# Altium project Bela_fan_control.PrjPcb
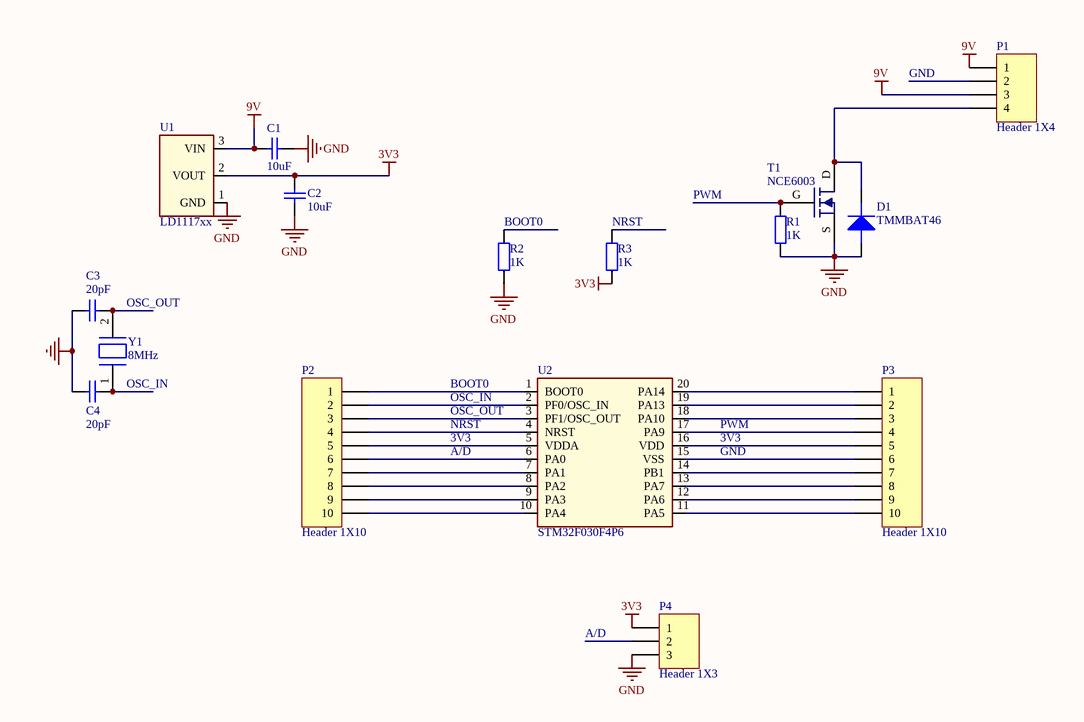
[diagram p0: Bela_fan_control.SchDoc]
1 sheet, 16 parts. Net scope: global (net labels, ports and power ports of the same name join across sheets).
Board file: Bela_fan_control.PcbDoc

## Sheet Bela_fan_control.SchDoc
size A3

### Parts
C1  10uF  [FP_1206_CAP_085]
C2  10uF  [FP_1206_CAP_085]
C3  20pF  [FP_0603_CAP_080]
C4  20pF  [FP_0603_CAP_080]
D1  TMMBAT46  [SOD-80]
P1  Header 1X4  [HEADER_2.54MM_M_1x4]
P2  Header 1X10  [HEADER_2.54MM_M_1x10]
P3  Header 1X10  [HEADER_2.54MM_M_1x10]
P4  Header 1X3  [HEADER_2.54MM_M_1x3]
R1  1K  [FP_0603_RES]
R2  1K  [FP_0603_RES]
R3  1K  [FP_0603_RES]
T1  NCE6003  [FET_SOT23]
U1  LD1117xx  [SUPPLY_SOT223]
U2  STM32F030F4P6  [uC_TSSOP20]
Y1  8MHz  [FP_CRYSTAL_HC49_SMD]

### Nets
3V3: C2.2 P2.5 P3.5 P4.1 R3.2 U1.2(VOUT) U2.5(VDDA) U2.16(VDD)
9V: C1.2 P1.1 P1.3 U1.3(VIN)
GND: C1.1 C2.1 C3.1 C4.1 D1.A P1.2 P3.6 P4.3 R1.2 R2.2 T1.S U1.1(GND) U2.15(VSS)
A/D: P2.6 P4.2 U2.6(PA0)
BOOT0: P2.1 R2.1 U2.1(BOOT0)
NRST: P2.4 R3.1 U2.4(NRST)
OSC_IN: C4.2 P2.2 U2.2(PF0/OSC_IN) Y1.1
OSC_OUT: C3.2 P2.3 U2.3(PF1/OSC_OUT) Y1.2
PWM: P3.4 R1.1 T1.G U2.17(PA9)
NetD1_K: D1.K P1.4 T1.D
NetP2_7: P2.7 U2.7(PA1)
NetP2_8: P2.8 U2.8(PA2)
NetP2_9: P2.9 U2.9(PA3)
NetP2_10: P2.10 U2.10(PA4)
NetP3_1: P3.1 U2.20(PA14)
NetP3_2: P3.2 U2.19(PA13)
NetP3_3: P3.3 U2.18(PA10)
NetP3_7: P3.7 U2.14(PB1)
NetP3_8: P3.8 U2.13(PA7)
NetP3_9: P3.9 U2.12(PA6)
NetP3_10: P3.10 U2.11(PA5)

### Library data of the parts
C1 C2 = Cap: Capacitor ceramic X7R; Value: 100nF; Order info: 82-08-03
C3 C4 = Cap: Capacitor; Part number: 20pF_0603_50V_NP0_5percent; Leírás: Capacitor ceramic NP0; Value: 20pF
D1 = DIODE_big: Part number: TMMBAT46FILM; Leírás: Diode   Schottky 0.15A 100 V; Sample: 83-00-65
P1 = Header 1X4: Header, 4-Pin; LatestRevisionDate: 17-Jul-2002; LatestRevisionNote: Re-released for DXP Platform.; Publisher: Altium Limited
P2 P3 = Header 1X10: Header, 10-Pin; LatestRevisionDate: 17-Jul-2002; LatestRevisionNote: Re-released for DXP Platform.; Publisher: Altium Limited
P4 = Header 1X3: Header, 3-Pin; LatestRevisionDate: 17-Jul-2002; LatestRevisionNote: Re-released for DXP Platform.; Publisher: Altium Limited
R1-R3 = RES: Resistor; Part number: 1k_0603_1percent; Value: 1K; Leírás: Resistor; Sample: 80-11-59
T1 = NMOS: N Channel 60V 3A 2V @ 250uA 105 mΩ @ 3A,10V 1.7W SOT-23(SOT-23-3) MOSFET RoHS; Leírás: N Channel 60V 3A 2V @ 250uA 105 mΩ @ 3A,10V 1.7W SOT-23(SOT-23-3) MOSFET RoHS; Part number: NCE6003; Sample: https://lcsc.com/product-detail/MOSFET_Wuxi-NCE-Power-Semiconductor-NCE6003_C112351.html
U1 = LD1117xx: LD1117xx 3,3V lin reg; Order info: 89-06-98
Y1 = XTAL: Quartz; Value: 8MHz
U2 = STM32F030F4P6: Part number: STM32F030F4P6